# Altium schematic sheet MCU.SchDoc
size A4; SheetNumber: 3; SheetTotal: 8
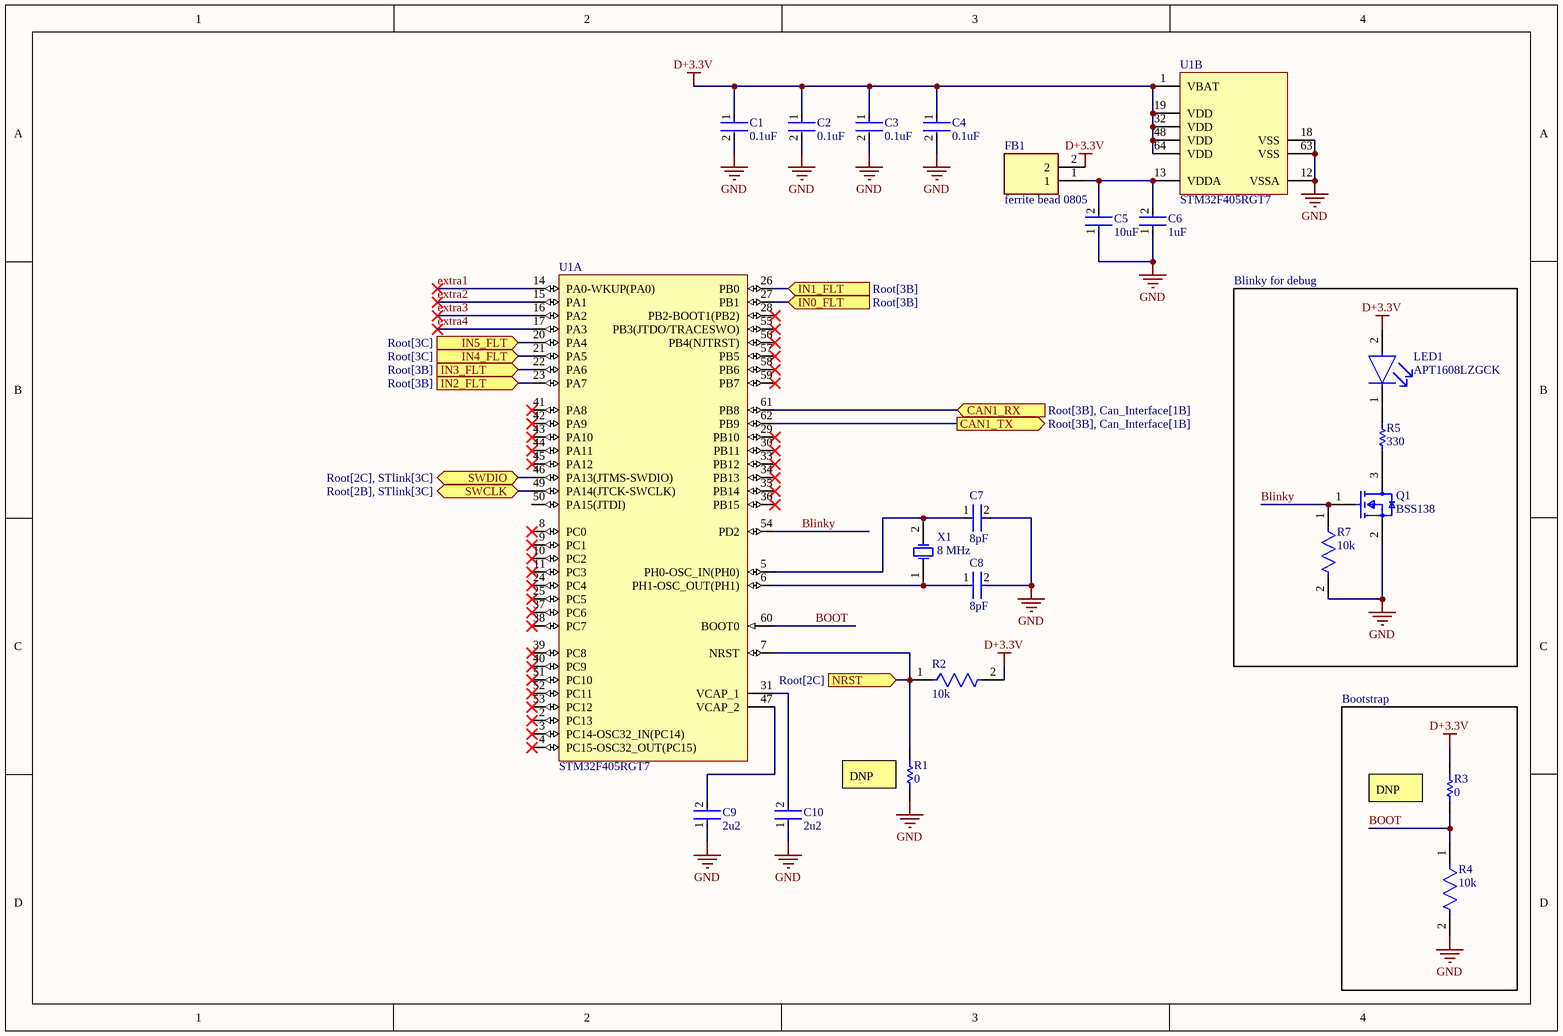
[diagram p0: MCU.SchDoc]

## Parts
C1  0.1uF  [FP-CC0603-DA-MFG]
C2  0.1uF  [FP-CC0603-DA-MFG]
C3  0.1uF  [FP-CC0603-DA-MFG]
C4  0.1uF  [FP-CC0603-DA-MFG]
C5  10uF  [FP-GRM21B-0_2-e0_2_0_7-IPC_C]
C6  1uF  [FP-CC0603-DA-MFG]
C7  8pF  [FP-C1608-080-0_1-IPC_C]
C8  8pF  [FP-C1608-080-0_1-IPC_C]
C9  2u2  [FP-CC0603-DA-MFG]
C10  2u2  [FP-CC0603-DA-MFG]
FB1  ferrite bead 0805  [FP-RC2012-IPC_A]
LED1  APT1608LZGCK  [FP-APT1608LZGCK-MFG]
Q1  BSS138  [FP-318-08-IPC_B]
R1  0  [RESC1608X55X25ML10T15]
R2  10k  [FP-RC0603-0_55-IPC_C]
R3  0  [RESC1608X55X25ML10T15]
R4  10k  [FP-RC0603-0_55-IPC_C]
R5  330  [RESC1608X55X25NL10T15]
R7  10k  [FP-RC0603-0_55-IPC_C]
U1  STM32F405RGT7  [STM-LQFP64_N]  (parts A,B of 2)
X1  8 MHz  [ABRA-ABM3-2_V]

## Blocks framed on the sheet
Blinky for debug: LED1 Q1 R5 R7
Bootstrap: R3 R4

## Ports
CAN1_RX (in, see Root[3B], Can_Interface[1B]), CAN1_TX (out, see Root[3B], Can_Interface[1B]), IN0_FLT (in, see Root[3B]), IN1_FLT (in, see Root[3B]), IN2_FLT (in, see Root[3B]), IN3_FLT (in, see Root[3B]), IN4_FLT (in, see Root[3C]), IN5_FLT (in, see Root[3C]), NRST (in, see Root[2C]), SWCLK (bidir, see Root[2B], STlink[3C]), SWDIO (bidir, see Root[2C], STlink[3C])

## Nets
D+3.3V: C1.1 C2.1 C3.1 C4.1 FB1.2 LED1.2(A) R2.2 R3.1 U1.1(VBAT) U1.19(VDD) U1.32(VDD) U1.48(VDD) U1.64(VDD)
GND: C1.2 C2.2 C3.2 C4.2 C5.1 C6.1 C7.2 C8.2 C9.1 C10.1 Q1.2(S) R1.1 R4.2 R7.2 U1.12(VSSA) U1.18(VSS) U1.63(VSS)
Blinky: Q1.1(G) R7.1 U1.54(PD2)
BOOT: R3.2 R4.1 U1.60(BOOT0)
CAN1_RX: U1.61(PB8) ; port CAN1_RX
CAN1_TX: U1.62(PB9) ; port CAN1_TX
extra1: U1.14(PA0-WKUP(PA0))
extra2: U1.15(PA1)
extra3: U1.16(PA2)
extra4: U1.17(PA3)
IN0_FLT: U1.27(PB1) ; port IN0_FLT
IN1_FLT: U1.26(PB0) ; port IN1_FLT
IN2_FLT: U1.23(PA7) ; port IN2_FLT
IN3_FLT: U1.22(PA6) ; port IN3_FLT
IN4_FLT: U1.21(PA5) ; port IN4_FLT
IN5_FLT: U1.20(PA4) ; port IN5_FLT
NRST: R1.2 R2.1 U1.7(NRST) ; port NRST
SWCLK: U1.49(PA14(JTCK-SWCLK)) ; port SWCLK
SWDIO: U1.46(PA13(JTMS-SWDIO)) ; port SWDIO
NetC5_2: C5.2 C6.2 FB1.1 U1.13(VDDA)
NetC7_1: C7.1 U1.5(PH0-OSC_IN(PH0)) X1.2(X2)
NetC8_1: C8.1 U1.6(PH1-OSC_OUT(PH1)) X1.1(X1)
NetC9_2: C9.2 U1.47(VCAP_2)
NetC10_2: C10.2 U1.31(VCAP_1)
NetLED1_1: LED1.1(C) R5.2
NetQ1_3: Q1.3(D) R5.1

Not connected (* = marked no-connect by the designer): U1 2(PC13)* 3(PC14-OSC32_IN(PC14))* 4(PC15-OSC32_OUT(PC15))* 8(PC0)* 9(PC1)* 10(PC2)* 11(PC3)* 24(PC4)* 25(PC5)* 28(PB2-BOOT1(PB2))* 29(PB10)* 30(PB11)* 33(PB12)* 34(PB13)* 35(PB14)* 36(PB15)* 37(PC6)* 38(PC7)* 39(PC8)* 40(PC9)* 41(PA8)* 42(PA9)* 43(PA10)* 44(PA11)* 45(PA12)* 50(PA15(JTDI)) 51(PC10)* 52(PC11)* 53(PC12)* 55(PB3(JTDO/TRACESWO))* 56(PB4(NJTRST))* 57(PB5)* 58(PB6)* 59(PB7)*

## Notes on the sheet
- (near R1) DNP
- (near R3) DNP

## Library data of the parts
C1-C4 = CMP-03422-000537-1: CAP CER 0.1UF 50V X7R 0603; Manufacturer: YAGEO; Manufacturer Part Number: CC0603MRX7R9BB104; Material: Ceramic; Capacitance: 100 nF; Temperature Coefficient: 15%; Tolerance: 0.2; Value: 100 nF; Temperature Range Low: -55°C; Height: 0.9mm; Temperature Range High: +125°C; Category: Cap; Package: CC0603-DA; Mouser Description: Cap Ceramic 50V 20% +Tol 20% -Tol X7R 15% TC 0.1uF SMD 0603; Temperature Characteristic: X7R; Footprint Url: http://www.yageo.com/exep/pages/download/literatures/UPY-C_GEN_24.pdf; Octopart: https://octopart.com/cc0603mrx7r9bb104-yageo-67308423; RoHS: TRUE; Voltage: 50 V; Lead Free: Yes; ComponentLink2URL: http://www.yageo.com/documents/recent/UPY-GPHC_X7R_6.3V-to-50V_18.pdf; ComponentLink2Description: Datasheet; Digikey Description: CAP CER 0.1UF 50V X7R 0603; Device Class L2: Capacitors; Automotive: No; Voltage Rating: 50 V; Temperature: -55°C to +125°C; Device Class L1: Passive Components; Device Class L3: Ceramic Capacitors
C5 = CMP-06035-007712-1: Chip Multilayer Ceramic Capacitors for General Purpose, 0805, 10uF, X7R, 15%, 10%, 16V
C6 = CMP-03422-001047-1: CC0603 1 uF X7R 10.00% 16 V; Manufacturer: YAGEO; Manufacturer Part Number: CC0603KPX7R7BB105; Temperature Coefficient: 15%; Tolerance: 0.1; Voltage Rating: 16 V; Material: Ceramic; Device Class L3: Ceramic Capacitors; Temperature Characteristic: X7R; Device Class L2: Capacitors; Temperature Range Low: -55°C; Footprint Url: http://www.yageo.com/exep/pages/download/literatures/UPY-C_GEN_24.pdf; Device Class L1: Passive Components; Temperature: -55°C to +125°C; RoHS: TRUE; ComponentLink2URL: http://www.yageo.com/documents/recent/UPY-GPHC_X7R_6.3V-to-50V_18.pdf; Mouser Description: Cap Ceramic 1uF 16V X7R 10% SMD 0603 125°C Paper T/R; Octopart: https://octopart.com/cc0603kpx7r7bb105-yageo-25629533; Automotive: No; Capacitance: 1 uF; Height: 0.9mm; Voltage: 16 V; Lead Free: Yes; Category: Cap; Package: CC0603-DA; Temperature Range High: +125°C; Value: 1 uF; ComponentLink2Description: Datasheet
C7 C8 = CMP-08246-003474-1: Multilayer Ceramic Capacitors 8pF ±0.5pF 50V NP0 SMD 0603; Dielectric: C0G; Series: C; Features: High Temperature; Case Code (Metric): 1608; Termination: SMD/SMT; Mount: Surface Mount; Package Quantity: 4000; Width: 0.031inch; Voltage Rating (DC): 50V; Height: 0.8mm; Case/Package: 0603; Lead Free: Lead Free; RoHS Compliant: Yes; Min Operating Temperature: -55°C; Capacitance: 8pF; Max Operating Temperature: 150°C; Weight: 7.1E-05oz; Thickness: 0.035inch; Packaging: Tape and Reel; Voltage Rating: 50V; Case Code (Imperial): 0603; Length: 0.063inch
C9 C10 = CMP-03422-001238-1: CAP CER 2.2UF 16V X7R 0603; Manufacturer: YAGEO; Manufacturer Part Number: CC0603KRX7R7BB225; Temperature Coefficient: 15%; Material: Ceramic; Tolerance: 0.1; Voltage: 16 V; Temperature Range High: +125°C; Digikey Description: CAP CER 2.2UF 16V X7R 0603; Temperature: -55°C to +125°C; Value: 2.2 uF; Lead Free: Yes; Capacitance: 2.2 uF; Package: CC0603-DA; ComponentLink2URL: http://www.yageo.com/documents/recent/UPY-GPHC_X7R_6.3V-to-50V_18.pdf; Device Class L1: Passive Components; Category: Cap; ComponentLink2Description: Datasheet; Mouser Description: Cap Ceramic 2.2uF 16V X7R 10% Pad SMD 0603 125C Automotive T/R; Device Class L2: Capacitors; RoHS: TRUE; Automotive: No; Voltage Rating: 16 V; Device Class L3: Ceramic Capacitors; Temperature Range Low: -55°C; Height: 0.9mm; Footprint Url: http://www.yageo.com/exep/pages/download/literatures/UPY-C_GEN_24.pdf; Temperature Characteristic: X7R; Octopart: https://octopart.com/cc0603krx7r7bb225-yageo-67146440
FB1 = FBMJ2125HS250NT: Manufacturer_Name: TAIYO YUDEN; Datasheet Link: https://mouser.componentsearchengine.com/Datasheets/1/FBMJ2125HS250NT.pdf; Height: 1.05mm; Manufacturer_Part_Number: FBMJ2125HS250NT; Mouser Part Number: 963-FBMJ2125HS250NT; Mouser Price/Stock: https://www.mouser.co.uk/ProductDetail/TAIYO-YUDEN/FBMJ2125HS250NT?qs=I6KAKw0tg2w%2F7qNkMvc%2FCQ%3D%3D; Arrow Part Number: FBMJ2125HS250NT; Arrow Price/Stock: null?region=nac
LED1 = CMP-44529-000040-1: LED GREEN CLEAR 2SMD; Dominant Wavelength: 525nm; Forward Voltage: 2.65V; Luminous Intensity: 50mcd; Test Current: 2mA; Viewing Angle: 120°; Lens Color: Colorless; Width: 0.8mm; Mount: Surface Mount; Lens Transparency: Clear; Length: 1.6mm; Packaging: Cut Tape; Case Code (Metric): 1608; Height: 0.75mm; Case/Package: 0603; Case Code (Imperial): 0603; Color: Green
Q1 = CMP-07173-000101-1: MOSFET N-CH 50V 220MA SOT-23; Turn-Off Delay Time: 20ns; Element Configuration: Single; Rds On Max: 3.5R; Gate to Source Voltage (Vgs): 20V; Threshold Voltage: 1.3V; Number of Elements: 1; Power Dissipation: 360mW; Rise Time: 9ns; Turn-On Delay Time: 2.5ns; Input Capacitance: 27pF; On-State Resistance: 6R; Lead Free: Lead Free; Length: 2.92mm; Width: 1.3mm; Drain to Source Breakdown Voltage: 50V; Min Operating Temperature: -55°C; REACH SVHC: No SVHC; Packaging: Tape and Reel; Radiation Hardening: No; Height: 0.93mm; Drain to Source Voltage (Vdss): 50V; Current Rating: 220mA; Voltage Rating (DC): 50V; Weight: 0.03g; Continuous Drain Current (ID): 220mA; Number of Pins: 3; Nominal Vgs: 1.3V; Max Power Dissipation: 360mW; Fall Time: 9ns; Drain to Source Resistance: 3.5R; Contact Plating: Tin; Case/Package: SOT-23; Package Quantity: 1; Dual Supply Voltage: 50V; Mount: Surface Mount; Termination: SMD/SMT; Max Operating Temperature: 150°C
R1 R3 = CMP-2100-03667-1: Chip Resistor, 0 Ohm, +/- 5%, 0.1 W, -55 to 155 degC, 0603 (1608 Metric), RoHS, Tape and Reel; Manufacturer: Yageo; Temperature Coefficient: 200ppm/degreesC; Voltage Rating: 50V; Power Rating: 100mW; Resistance: 0mOhm; Width: 0.8mm; Max Operating Temperature: 155degC; Tolerance: 5%; Package Reference: 0603; Height: 0.45mm; Depth: 0.8mm; Package Description: 2-Pin Surface Mount Device, Body 1.6 x 0.8 mm; Termination: SMD/SMT; Package Quantity: 5000; Case/Package: 0603; Case Code (Imperial): 0603; Radiation Hardening: No; Number of Pins: 2; Length: 1.6mm; Lead Free: LeadFree; Voltage Rating (DC): 50V; Military Standard: Not; Datasheet URL: http://www.yageo.com/NewPortal/yageodocoutput?fileName=/pdf/R-Chip/PYu-RC_Group_51_RoHS_L_5.pdf; Manufacturer URL: http://www.yageo.com/; Packaging: TapeandReel; Case Code (Metric): 1608; Min Operating Temperature: -55degC; Composition: ThickFilm; RoHSCompliant: true; Contact Plating: Tin; Datasheet Version: Rev. 5, 10/2016; REACH SVHC: NoSVHC
R2 R4 R7 = CMP-2100-03664-2: RES 10K OHM 1% 1/10W 0603; Voltage Rating: 75V; Voltage Rating (DC): 50V; Resistance: 10kR; Power Rating: 100mW; Temperature Coefficient: 100ppm/°C; Depth: 0.8mm; Termination: SMD/SMT; Resistor Type: Thick Film; Series: RC; Construction: Rectangular; Features: Moisture Resistant; Packaging: Tape and Reel; Min Operating Temperature: -55°C; Number of Terminations: 2; Lead Pitch: 0.3mm; RoHS Compliant: Yes; Case/Package: 0603; Resistance Tolerance: 1%; Military Standard: Not; Weight: 7.1E-05oz; Number of Pins: 2; Tolerance: 1%; Length: 1.6mm; Case Code (Imperial): 0603; Lead Free: Lead Free; Width: 0.8mm; Max Power Dissipation: 100mW; Height: 0.45mm; Max Operating Temperature: 155°C; Case Code (Metric): 1608; Size Code: 0603
R5 = CMP-1659-00020-2: Chip Resistor, 330 Ohm, +/- 1%, 0.1 W, -55 to 155 degC, 0603 (1608 Metric), RoHS, Tape and Reel; Tolerance: 10%; ESR: 800 mohm; Voltage Rating (DC): 16 V; Capacitance: 47 uF; Length: 7.3 mm; ComponentLink1URL: http://www.yageo.com/; Packaging: Tape and Reel; Pins: 2; ComponentLink1Description: Manufacturer URL; Case Code (Imperial): 2917; REACH SVHC: No SVHC; Width: 4.3 mm; ComponentLink2Description: Datasheet; Voltage Rating: 16 V; RoHSCompliant: True; Max Operating Temperature: 125degC; ComponentLink2URL: http://www.yageo.com/documents/recent/PYu-RC_Group_51_RoHS_L_04.pdf; Min Operating Temperature: -55degC; Case/Package: 2917; Radiation Hardening: No; DatasheetVersion: Rev. 4, 02/2016; Mount: Surface Mount; PackageReference: 0603; Package Quantity: 500; Case Code (Metric): 7343; PackageDescription: 2-Pin Surface Mount Device, Body 1.6 x 0.8 mm; Height: 3.1 mm
U1 = CMP-0243-00093-2: ARM Cortex-M4 32-bit MCU+FPU, 210 DMIPS, 1024 kB Flash, 192 kB Internal RAM, 51 I/Os, 64-pin LQFP, -40 to 105 degC, Tray; Manufacturer: STMicroelectronics; D/A Converter: 2x12-bit; Internal RAM Size (kB): 192; Supply Voltage(Vcc) min (V): 1.8; Supply Voltage(Vcc) max (V): 3.6; FLASH Size (Prog) (kB): 1024; I/Os (High Current): 51; Operating Frequency(F) (Processor speed) (MHz): 168; PackageVersion: Rev. 4, 06/2013; PackageDescription: 64-Pin Low Profile Quad Flat Package, 10 x 10 mm Body, 0.5 mm Pitch; Packing: Tray; ComponentLink2Description: Datasheet; PackageReference: LQFP64; ComponentLink1URL: http://www.st.com/web/en/home.html; ComponentLink2URL: http://www.st.com/st-web-ui/static/active/en/resource/technical/document/datasheet/DM00037051.pdf; ComponentLink1Description: Manufacturer URL; Core: ARM Cortex-M4; PartNumber: STM32F405RGT7; Mounting Technology: Surface Mount; DatasheetVersion: Rev. 4; ComponentLink3URL: http://www.st.com/st-web-ui/static/active/en/resource/technical/document/datasheet/DM00037051.pdf; ComponentLink3Description: Package Specification
X1 = CMP-2000-05033-1: AA-8.000MALV-T; Manufacturer: ABRACON; Case Length: 5mm; Case Width: 3.2mm; Case Height: 1.3mm; Load Capacitance: 18pF; Frequency: 8MHz; Frequency Stability: 30PPM; ESR: 140Ohms; Tolerance: 20PPM; Type: MiniatureCeramicCrystal; Factory Pack Quantity: 1000; Package / Case: 5mmx3.2mm; Mounting Style: SMD/SMT; Manufacturer URL: http://www.abracon.com/; RoHS: Details; Dimensions: 3.2mmWx5mmLx1.3mmH; Datasheet URL: http://www.farnell.com/datasheets/1754353.pdf; Brand: ABRACON; Packaging: Reel; Product Category: Crystals; Package Description: 2-Pin Surface Mount Device, Body 5 x 3.2 mm; Package URL: http://www.abracon.com/Support/PackageDrawing/Resonators/ABM3.PDF; Operating Temperature Range: -40Cto+85C; Termination Style: SMD/SMT; Datasheet Version: Sep-13; Series: ABM3; Package Reference: ABM3-2